# Altium schematic sheet Power_sources_selector.SchDoc
size A4; SheetNumber: 5; SheetTotal: 6
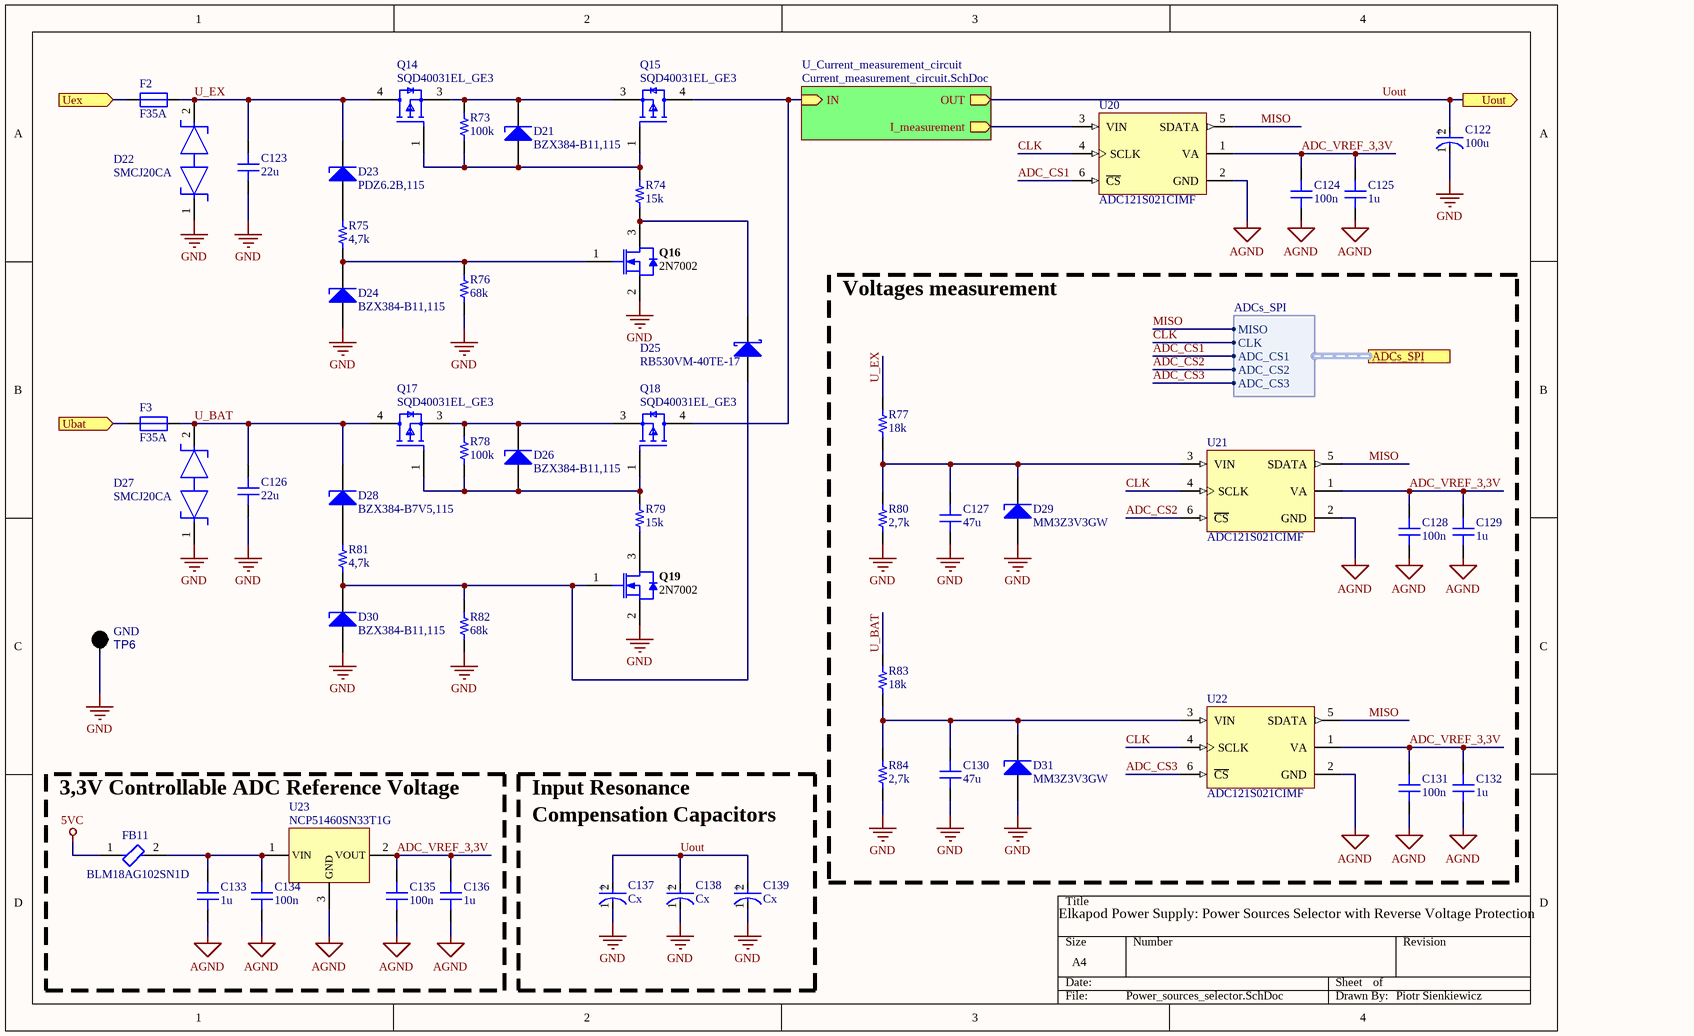
[diagram p0: Power_sources_selector.SchDoc]

## Parts
C122  100u  [FP-FKE-MFG]
C123  22u  [CAP 0805_2012]
C124  100n  [CAP 0603_1608]
C125  1u  [CAP 0603_1608]
C126  22u  [CAP 0805_2012]
C127  47u  [CAP 0603_1608]
C128  100n  [CAP 0603_1608]
C129  1u  [CAP 0603_1608]
C130  47u  [CAP 0603_1608]
C131  100n  [CAP 0603_1608]
C132  1u  [CAP 0603_1608]
C133  1u  [CAP 0603_1608]
C134  100n  [CAP 0603_1608]
C135  100n  [CAP 0603_1608]
C136  1u  [CAP 0603_1608]
C137  Cx  [FP-FKE-MFG]
C138  Cx  [FP-FKE-MFG]
C139  Cx  [FP-FKE-MFG]
D21  BZX384-B11,115  [SOD323]
D22  SMCJ20CA  [FP-SMC-CA-MFG]
D23  PDZ6.2B,115  [SOD323]
D24  BZX384-B11,115  [SOD323]
D25  RB530VM-40TE-17  [SOD-323]
D26  BZX384-B11,115  [SOD323]
D27  SMCJ20CA  [FP-SMC-CA-MFG]
D28  BZX384-B7V5,115  [SOD323]
D29  MM3Z3V3GW  [SOD323]
D30  BZX384-B11,115  [SOD323]
D31  MM3Z3V3GW  [SOD323]
F2  F35A  [6,3x32_fuse_PCB]
F3  F35A  [6,3x32_fuse_PCB]
FB11  BLM18AG102SN1D  [FP-BLM18-0_15-t0_8-MFG]
Q14  SQD40031EL_GE3  [FP-T13-0592-MFG]
Q15  SQD40031EL_GE3  [FP-T13-0592-MFG]
Q16  2N7002  [INF-PG-SOT23_M]
Q17  SQD40031EL_GE3  [FP-T13-0592-MFG]
Q18  SQD40031EL_GE3  [FP-T13-0592-MFG]
Q19  2N7002  [INF-PG-SOT23_M]
R73  100k  [RES 0603_1608]
R74  15k  [RES 0603_1608]
R75  4,7k  [RES 0603_1608]
R76  68k  [RES 0603_1608]
R77  18k  [RES 0603_1608]
R78  100k  [RES 0603_1608]
R79  15k  [RES 0603_1608]
R80  2,7k  [RES 0603_1608]
R81  4,7k  [RES 0603_1608]
R82  68k  [RES 0603_1608]
R83  18k  [RES 0603_1608]
R84  2,7k  [RES 0603_1608]
TP6  GND  [Keystone_5006_BLACK]
U20  ADC121S021CIMF  [DBV0006A_M]
U21  ADC121S021CIMF  [DBV0006A_M]
U22  ADC121S021CIMF  [DBV0006A_M]
U23  NCP51460SN33T1G  [SOT23-3]

## Blocks framed on the sheet
Voltages measurement: C127-C132 D29 D31 R77 R80 R83 R84 U21 U22
3,3V Controllable ADC Reference Voltage: C133-C136 FB11 U23

## Sub-sheets
U_Current_measurement_circuit = Current_measurement_circuit.SchDoc: I_measurement (out), IN (in), OUT (out)  | Rsense_value: 0,5m

## Ports
ADCs_SPI (harness ADCs_SPI, see Elkapod_power_supply_conveter_module[2A]), Ubat (in, see Elkapod_power_supply_conveter_module[1A]), Uex (in, see Elkapod_power_supply_conveter_module[1A]), Uout (out, see Elkapod_power_supply_conveter_module[2A])

## Harnesses
ADCs_SPI: MISO, CLK, ADC_CS1, ADC_CS2, ADC_CS3

## Nets
5VC: FB11.1
AGND: C124.1 C125.1 C128.1 C129.1 C131.1 C132.1 C133.1 C134.1 C135.1 C136.1 U20.2(GND) U21.2(GND) U22.2(GND) U23.3(GND)
GND: C122.1(C) C123.1 C126.1 C127.1 C130.1 C137.1(C) C138.1(C) C139.1(C) D22.1 D24.1(A) D27.1 D29.1(A) D30.1(A) D31.1(A) Q16.2(SOURCE) Q19.2(SOURCE) R76.1 R80.2 R82.1 R84.2 TP6.0
ADC_CS1: U20.6(~{CS}) ; port ADCs_SPI.ADC_CS1
ADC_CS2: U21.6(~{CS}) ; port ADCs_SPI.ADC_CS2
ADC_CS3: U22.6(~{CS}) ; port ADCs_SPI.ADC_CS3
ADC_VREF_3,3V: C124.2 C125.2 C128.2 C129.2 C131.2 C132.2 C135.2 C136.2 U20.1(VA) U21.1(VA) U22.1(VA) U23.2(VOUT)
CLK: U20.4(SCLK) U21.4(SCLK) U22.4(SCLK) ; port ADCs_SPI.CLK
MISO: U20.5(SDATA) U21.5(SDATA) U22.5(SDATA) ; port ADCs_SPI.MISO
U_BAT: C126.2 D27.2 D28.2(K) F3.2 Q17.4(D) R83.1
U_EX: C123.2 D22.2 D23.2(K) F2.2 Q14.4(D) R77.1
Ubat: F3.1 ; port Ubat
Uex: F2.1 ; port Uex
Uout: C122.2(A) C137.2(A) C138.2(A) C139.2(A) ; port Uout, sheet U_Current_measurement_circuit/OUT
NetC127_2: C127.2 D29.2(K) R77.2 R80.1 U21.3(VIN)
NetC130_2: C130.2 D31.2(K) R83.2 R84.1 U22.3(VIN)
NetC133_2: C133.2 C134.2 FB11.2 U23.1(VIN)
NetD21_1: D21.1(A) Q14.1(G) Q15.1(G) R73.1 R74.2
NetD21_2: D21.2(K) Q14.3(S) Q15.3(S) R73.2
NetD23_1: D23.1(A) R75.2
NetD24_2: D24.2(K) Q16.1(GATE) R75.1 R76.2
NetD25_1: D25.1(K) Q16.3(DRAIN) R74.1
NetD25_2: D25.2(A) D30.2(K) Q19.1(GATE) R81.1 R82.2
NetD26_1: D26.1(A) Q17.1(G) Q18.1(G) R78.1 R79.2
NetD26_2: D26.2(K) Q17.3(S) Q18.3(S) R78.2
NetD28_1: D28.1(A) R81.2
NetQ15_4: Q15.4(D) Q18.4(D) ; sheet U_Current_measurement_circuit/IN
NetQ19_3: Q19.3(DRAIN) R79.1
NetU20_3: U20.3(VIN) ; sheet U_Current_measurement_circuit/I_measurement

## Notes on the sheet
- Input Resonance
- Compensation Capacitors
- Elkapod Power Supply: Power Sources Selector with Reverse Voltage Protection
- Piotr Sienkiewicz
- (in symbol CMP-2000-06205-2) +

## Library data of the parts
C122 = CMP-2000-06205-2: CAP ALUM 100UF 20% 25V SMD; Ripple Current (AC): 300mA; Leakage Current: 3uA; Dielectric Material: Aluminium; Impedance: 260mR; Life (Hours): 2000Hour; Max Operating Temperature: 105°C; Voltage Rating (DC): 25V; Packaging: Tape and Reel; Min Operating Temperature: -55°C; Capacitance: 100uF; Ripple Current: 300mA; Mount: Surface Mount; Lead Free: Lead Free; Construction: Cylindrical; Voltage Rating: 25V; RoHS Compliant: Yes; Case/Package: Radial; Height: 6.2mm; Tolerance: 20%; Diameter: 8mm; Termination: SMD/SMT; Package Quantity: 1; Width: 8.3mm; REACH SVHC: No SVHC; Series: FK; Number of Pins: 2; Voltage: 25V; Radiation Hardening: No; Height - Seated (Max): 0.244inch; Length: 6.2mm; ESR (Equivalent Series Resistance): 260mR
C123 C126 = VJ0805Y684KXQTW1BC: CAP CER 22UF 25V X7R 0805; manufacturer: Vishay Vitramon; Tolerance: ±10%; Voltage - Rated: 10V; Part Number: VJ0805Y684KXQTW1BC; Value: 22u; Applications: General Purpose; Capacitance: 22u; componentlink1description: Datasheet; componentlink1url: https://www.vishay.com/docs/28548/vjw1bcbascomseries.pdf; componentlink2description: DigiKey Link; componentlink2url: https://www.digikey.com/en/products/detail/vishay-vitramon/VJ0805Y684KXQTW1BC/8313569; Device Package: 0805 (2012 Metric); lastupdated: 09.02.2024 20:13:13; Lifecycle Status: Active; Minimum Order: 1; Mounting Type: Surface Mount, MLCC; Operating Temperature: -55°C ~ 125°C; Package / Case: 0805 (2012 Metric); packaging: TapeAndReel; partid: 57262; price: 0.05; series: VJ W1BC; Size / Dimension: 0.079" L x 0.049" W (2.00mm x 1.25mm); Temperature Coefficient: X7R; Thickness (Max): 0.053" (1.35mm)
C124 C128 C131 C134 C135 = C0603C272F3GAC7867: CAP CER 100nF 25V X5R 0603; manufacturer: KEMET; Temperature Coefficient: C0G, NP0; Tolerance: ±1%; Part Number: C0603C272F3GAC7867; Value: 100n; Applications: General Purpose; Capacitance: 100n; componentlink1description: Datasheet; componentlink1url: https://api.kemet.com/component-edge/download/datasheet/C0603C272F3GACTU.pdf; componentlink2description: DigiKey Link; componentlink2url: https://www.digikey.com/en/products/detail/kemet/C0603C272F3GAC7867/2200413; Device Package: 0603 (1608 Metric); Features: Low ESL; lastupdated: 09.02.2024 20:10:30; Lifecycle Status: Active; Minimum Order: 1; Mounting Type: Surface Mount, MLCC; Operating Temperature: -55°C ~ 125°C; Package / Case: 0603 (1608 Metric); packaging: TapeAndReel; partid: 2138; Part Status: Active; price: 0.40; series: SMD Comm C0G; Size / Dimension: 0.063" L x 0.031" W (1.60mm x 0.80mm); Thickness (Max): 0.034" (0.87mm); Voltage - Rated: 25V
C125 C129 C132 C133 C136 = C0603C272F3GAC7867: CAP CER 1uF 16V X5R 0603; manufacturer: KEMET; Temperature Coefficient: C0G, NP0; Tolerance: ±1%; Voltage - Rated: 25V; Part Number: C0603C272F3GAC7867; Value: 1u; Applications: General Purpose; Capacitance: 1u; componentlink1description: Datasheet; componentlink1url: https://api.kemet.com/component-edge/download/datasheet/C0603C272F3GACTU.pdf; componentlink2description: DigiKey Link; componentlink2url: https://www.digikey.com/en/products/detail/kemet/C0603C272F3GAC7867/2200413; Device Package: 0603 (1608 Metric); Features: Low ESL; lastupdated: 09.02.2024 20:10:30; Lifecycle Status: Active; Minimum Order: 1; Mounting Type: Surface Mount, MLCC; Operating Temperature: -55°C ~ 125°C; Package / Case: 0603 (1608 Metric); packaging: TapeAndReel; partid: 2138; Part Status: Active; price: 0.40; series: SMD Comm C0G; Size / Dimension: 0.063" L x 0.031" W (1.60mm x 0.80mm); Thickness (Max): 0.034" (0.87mm)
C127 C130 = C0603C272F3GAC7867: CAP CER 47uF 6,3V X5R 0603; manufacturer: KEMET; Temperature Coefficient: C0G, NP0; Tolerance: ±1%; Voltage - Rated: 25V; Part Number: C0603C272F3GAC7867; Value: 47u; Applications: General Purpose; Capacitance: 47u; componentlink1description: Datasheet; componentlink1url: https://api.kemet.com/component-edge/download/datasheet/C0603C272F3GACTU.pdf; componentlink2description: DigiKey Link; componentlink2url: https://www.digikey.com/en/products/detail/kemet/C0603C272F3GAC7867/2200413; Device Package: 0603 (1608 Metric); Features: Low ESL; lastupdated: 09.02.2024 20:10:30; Lifecycle Status: Active; Minimum Order: 1; Mounting Type: Surface Mount, MLCC; Operating Temperature: -55°C ~ 125°C; Package / Case: 0603 (1608 Metric); packaging: TapeAndReel; partid: 2138; Part Status: Active; price: 0.40; series: SMD Comm C0G; Size / Dimension: 0.063" L x 0.031" W (1.60mm x 0.80mm); Thickness (Max): 0.034" (0.87mm)
C137-C139 = CMP-2000-06205-2: CAP ALUM xUF 20% 25V SMD; Ripple Current (AC): 300mA; Leakage Current: 3uA; Dielectric Material: Aluminium; Impedance: 260mR; Life (Hours): 2000Hour; Max Operating Temperature: 105°C; Voltage Rating (DC): 25V; Packaging: Tape and Reel; Min Operating Temperature: -55°C; Capacitance: Cx; Ripple Current: 300mA; Mount: Surface Mount; Lead Free: Lead Free; Construction: Cylindrical; Voltage Rating: 25V; RoHS Compliant: Yes; Case/Package: Radial; Height: 6.2mm; Tolerance: 20%; Diameter: 8mm; Termination: SMD/SMT; Package Quantity: 1; Width: 8.3mm; REACH SVHC: No SVHC; Series: FK; Number of Pins: 2; Voltage: 25V; Radiation Hardening: No; Height - Seated (Max): 0.244inch; Length: 6.2mm; ESR (Equivalent Series Resistance): 260mR
D21 D24 D26 D30 = Zener_Diode_SOD323: 11V, 0,3W Zener diode
D22 D27 = CMP-07401-000031-1: TVS DIODE 20VWM 32.4VC SMC; Element Configuration: Single; Min Breakdown Voltage: 22.2V; Number of Elements: 1; Reverse Standoff Voltage: 20V; Peak Pulse Current: 46.3A; Direction: Bidirectional; Operating Supply Voltage: 3.5V; Max Surge Current: 200A; Breakdown Voltage: 25.5V; Leakage Current: 5uA; Clamping Voltage: 32.4V; Test Current: 1mA; Diode Type: ZENER; Power Line Protection: No; Peak Pulse Power: 1.5kW; Number of Bidirectional Channels: 1; Package Quantity: 3000; Resistor Type: Zener; Series: SMCJ; Min Operating Temperature: -55°C; Mount: Surface Mount; Max Reverse Leakage Current: 5uA; Case/Package: DO-214AB; Number of Channels: 1; Number of Pins: 2; Polarity: Bidirectional; Termination: SMD/SMT; RoHS Compliant: Yes; Radiation Hardening: No; Reverse Breakdown Voltage: 22.2V; Packaging: Tape and Reel; Max Operating Temperature: 150°C
D23 = Zener_Diode_SOD323: 6,2V, 0,4W Zener diode
D25 = BAS140W: Schottky diode; 0,1A; 40V; Published: 21-Mar-2003; LatestRevisionDate: 19-Mar-2004; LatestRevisionNote: Silkscreen size reduced.; DatasheetDocument: Oct-1999; PackageDocument: Sep-2000; PackageReference: SOD-323; Publisher: Altium Limited; ComponentLink1Description: Manufacturer Link; ComponentLink1URL: http://www.infineon.com/; ComponentLink2Description: Datasheet; ComponentLink2URL: http://www.infineon.com/upload/Document/cmc_upload/documents/009/386/bas70_bas170series_1.pdf
D28 = Zener_Diode_SOD323: 7,5V, 0,3W Zener diode
D29 D31 = Zener_Diode_SOD323: 3,3V, 0,3W Zener diode; SOD323
F2 F3 = 6,3x32_FUSE
FB11 = CMP-0686-00457-3: Chip Ferrite Bead, 0603, 1000Ω @ 100MHz, 0.5Ω, 25%, 450mA; Number of Circuits: 1; Max DC Current: 400mA; Shielding: Unshielded; DC Resistance (DCR): 500mR; Material: Steel; DC Resistance-Max: 700mR; Impedance: 1kR; Case Code (Imperial): 0603; Max Current Rating: 400mA; Frequency: 100MHz; Min Operating Temperature: -55°C; Case/Package: 0603; Depth: 0.8mm; Lead Free: Lead Free; Core Material: Ferrite; Current Rating: 400mA; Resistance: 500mR; Case Code (Metric): 1608; DC Current: 400mA; Package Quantity: 1; Packaging: Tape and Reel; Width: 0.8mm; Military Standard: Not; Height: 0.8mm; Series: BLM18A; Max Operating Temperature: 125°C; Tolerance: 25%; Termination: SMD/SMT; Test Frequency: 100MHz; Number of Lines: 1; Number of Pins: 2; REACH SVHC: No SVHC; Length: 1.6mm; Radiation Hardening: No
Q14 Q15 Q17 Q18 = CMP-00030-91482453-1: SQD40031EL_GE3 Transistor MOSFET P-CH 30V 100A 3-Pin TO-252; Max Junction Temperature (Tj): 175°C; Continuous Drain Current (ID): -100A; Drain to Source Resistance: 2.63mΩ; Turn-On Delay Time: 16ns; Drain to Source Voltage (Vdss): -30V; Turn-Off Delay Time: 126ns; Power Dissipation: 136W; Gate to Source Voltage (Vgs): 20V; Number of Channels: 1; RoHS: Non-Compliant; NexarPartId: 91482453; Max Operating Temperature: 175°C; Drain to Source Breakdown Voltage: -30V; Height: 2.507mm; Min Operating Temperature: -55°C
Q16 Q19 = CMP-1149-00026-1: N-Channel OptiMOS Small-Signal-Transistor, 60 V VDS, 0.3 A ID, -55 to 150 degC, PG-SOT23, Reel, Green; Manufacturer: Infineon; RDS (on) (max) (@4.5V): 4,000 mOhm; VDS (max): 60 V; IDpuls (max): 1.2Â A; QG: 0.4Â nC; RDS (on) (max): 3,000 mOhm; RthJA (max): 250 K/W; ID (max): 0.3Â A; VGS(th) (max): 2.5Â V; VGS(th) (min): 1.5Â V; Green: TRUE; Ptot (max): 0.5Â W; PackageDescription: 3-Pin Small Outline Transistor Package, 2.9 x 1.3 mm Body, 0.95 mm Pitch; Halogen-free: TRUE; ComponentLink2Description: Datasheet; ComponentLink1URL: http://www.infineon.com/; Packing: Reel; DatasheetVersion: Rev. 2.4; PartNumber: 2N7002; PackageReference: PG-SOT23; PackageVersion: Apr-08; ComponentLink3URL: http://www.infineon.com/dgdl/SOT23-Package_Overview.pdf?folderId=db3a30431936bc4b0119532290053c66&fileId=db3a30431936bc4b0119533468123c85; ComponentLink1Description: Manufacturer URL; Mounting Technology: Surface Mount; ComponentLink3Description: Package Specification; ComponentLink2URL: http://www.infineon.com/dgdl/2N7002_Rev2.4.pdf?folderId=db3a3043156fd573011622e10b5c1f67&fileId=db3a304319bc939a0119c2a9461e79e6
R73 R78 = RNCS0603BKE10K0: RES 100K OHM 1% 0,1W 0603; Manufacturer: Stackpole Electronics Inc; Power (Watts): 0.063W, 1/16W; Temperature Coefficient: ±25ppm/°C; Tolerance: ±0.1%; Part Number: RNCS0603BKE10K0; Value: 100k; Composition: Thin Film; Device Package: 0603 (1608 Metric); Features: Anti-Corrosive, Automotive AEC-Q200, Moisture Resistant; Height - Seated (Max): 0.022" (0.55mm); LastUpdated: 09.02.2024 20:43:37; Lifecycle Status: Active; Minimum Order: 1; Number of Terminations: 2; Operating Temperature: -55°C ~ 155°C; Package / Case: 0603 (1608 Metric); Packaging: TapeAndReel; PartId: 4838; Part Status: Active; Price: 0.06; Ratings: AEC-Q200; Resistance: 100k; Series: RNCS; Size / Dimension: 0.061" L x 0.031" W (1.55mm x 0.80mm); Supplier Device Package: 0603
R74 R79 = RNCS0603BKE10K0: RES 15K OHM 1% 0,1W 0603; Manufacturer: Stackpole Electronics Inc; Power (Watts): 0.063W, 1/16W; Temperature Coefficient: ±25ppm/°C; Tolerance: ±0.1%; Part Number: RNCS0603BKE10K0; Value: 15k; Composition: Thin Film; Device Package: 0603 (1608 Metric); Features: Anti-Corrosive, Automotive AEC-Q200, Moisture Resistant; Height - Seated (Max): 0.022" (0.55mm); LastUpdated: 09.02.2024 20:43:37; Lifecycle Status: Active; Minimum Order: 1; Number of Terminations: 2; Operating Temperature: -55°C ~ 155°C; Package / Case: 0603 (1608 Metric); Packaging: TapeAndReel; PartId: 4838; Part Status: Active; Price: 0.06; Ratings: AEC-Q200; Resistance: 15k; Series: RNCS; Size / Dimension: 0.061" L x 0.031" W (1.55mm x 0.80mm); Supplier Device Package: 0603
R75 R81 = RNCS0603BKE10K0: RES 4,7K OHM 1% 0,1W 0603; Manufacturer: Stackpole Electronics Inc; Power (Watts): 0.063W, 1/16W; Temperature Coefficient: ±25ppm/°C; Tolerance: ±0.1%; Part Number: RNCS0603BKE10K0; Value: 4,7k; Composition: Thin Film; Device Package: 0603 (1608 Metric); Features: Anti-Corrosive, Automotive AEC-Q200, Moisture Resistant; Height - Seated (Max): 0.022" (0.55mm); LastUpdated: 09.02.2024 20:43:37; Lifecycle Status: Active; Minimum Order: 1; Number of Terminations: 2; Operating Temperature: -55°C ~ 155°C; Package / Case: 0603 (1608 Metric); Packaging: TapeAndReel; PartId: 4838; Part Status: Active; Price: 0.06; Ratings: AEC-Q200; Resistance: 4,7k; Series: RNCS; Size / Dimension: 0.061" L x 0.031" W (1.55mm x 0.80mm); Supplier Device Package: 0603
R76 R82 = RNCS0603BKE10K0: RES 68K OHM 1% 0,1W 0603; Manufacturer: Stackpole Electronics Inc; Power (Watts): 0.063W, 1/16W; Temperature Coefficient: ±25ppm/°C; Tolerance: ±0.1%; Part Number: RNCS0603BKE10K0; Value: 68k; Composition: Thin Film; Device Package: 0603 (1608 Metric); Features: Anti-Corrosive, Automotive AEC-Q200, Moisture Resistant; Height - Seated (Max): 0.022" (0.55mm); LastUpdated: 09.02.2024 20:43:37; Lifecycle Status: Active; Minimum Order: 1; Number of Terminations: 2; Operating Temperature: -55°C ~ 155°C; Package / Case: 0603 (1608 Metric); Packaging: TapeAndReel; PartId: 4838; Part Status: Active; Price: 0.06; Ratings: AEC-Q200; Resistance: 68k; Series: RNCS; Size / Dimension: 0.061" L x 0.031" W (1.55mm x 0.80mm); Supplier Device Package: 0603
R77 R83 = RNCS0603BKE10K0: RES 18K OHM 1% 0,1W 0603; Manufacturer: Stackpole Electronics Inc; Power (Watts): 0.063W, 1/16W; Temperature Coefficient: ±25ppm/°C; Tolerance: ±0.1%; Part Number: RNCS0603BKE10K0; Value: 18k; Composition: Thin Film; Device Package: 0603 (1608 Metric); Features: Anti-Corrosive, Automotive AEC-Q200, Moisture Resistant; Height - Seated (Max): 0.022" (0.55mm); LastUpdated: 09.02.2024 20:43:37; Lifecycle Status: Active; Minimum Order: 1; Number of Terminations: 2; Operating Temperature: -55°C ~ 155°C; Package / Case: 0603 (1608 Metric); Packaging: TapeAndReel; PartId: 4838; Part Status: Active; Price: 0.06; Ratings: AEC-Q200; Resistance: 18k; Series: RNCS; Size / Dimension: 0.061" L x 0.031" W (1.55mm x 0.80mm); Supplier Device Package: 0603
R80 R84 = RNCS0603BKE10K0: RES 2,7K OHM 1% 0,1W 0603; Manufacturer: Stackpole Electronics Inc; Power (Watts): 0.063W, 1/16W; Temperature Coefficient: ±25ppm/°C; Tolerance: ±0.1%; Part Number: RNCS0603BKE10K0; Value: 2,7k; Composition: Thin Film; Device Package: 0603 (1608 Metric); Features: Anti-Corrosive, Automotive AEC-Q200, Moisture Resistant; Height - Seated (Max): 0.022" (0.55mm); LastUpdated: 09.02.2024 20:43:37; Lifecycle Status: Active; Minimum Order: 1; Number of Terminations: 2; Operating Temperature: -55°C ~ 155°C; Package / Case: 0603 (1608 Metric); Packaging: TapeAndReel; PartId: 4838; Part Status: Active; Price: 0.06; Ratings: AEC-Q200; Resistance: 2,7k; Series: RNCS; Size / Dimension: 0.061" L x 0.031" W (1.55mm x 0.80mm); Supplier Device Package: 0603
TP6 = Keystone 5006 Test Point: Keystone 5006 Test Point (BLACK)
U20-U22 = CMP-0054-00268-3: Single Channel, 50 to 200 kSPS, 12-Bit A/D Converter, 6-pin SOT-23; Manufacturer: Texas Instruments; PackageTopMarking: X07C*XTT; CompType: ADC IC; PowerWise: Y; Code_IPC: SOT26A-6; PackageReference: DBV0006A; ComponentLink1Description: Datasheet URL; PinCount: 6; ComponentLink1URL: http://www.ti.com/general/docs/lit/getliterature.tsp?genericPartNumber=ADC121S021&fileType=pdf; PackageDescription: Molded SOT-23, .115 x .063 x .040in Body, 6 Lead, .0375in in Pitch; RoHS: N; Code_JEDEC: MO-178-AB
U23 = NCP51460SN33T1G: Low power precision voltage reference; Iout = 20mA